# EAGLE design board (EAGLE 9.3.0)
CNAME: MAKER_Sensor_Node; CREVISION: V1.0; DESIGNER: Kihun Song
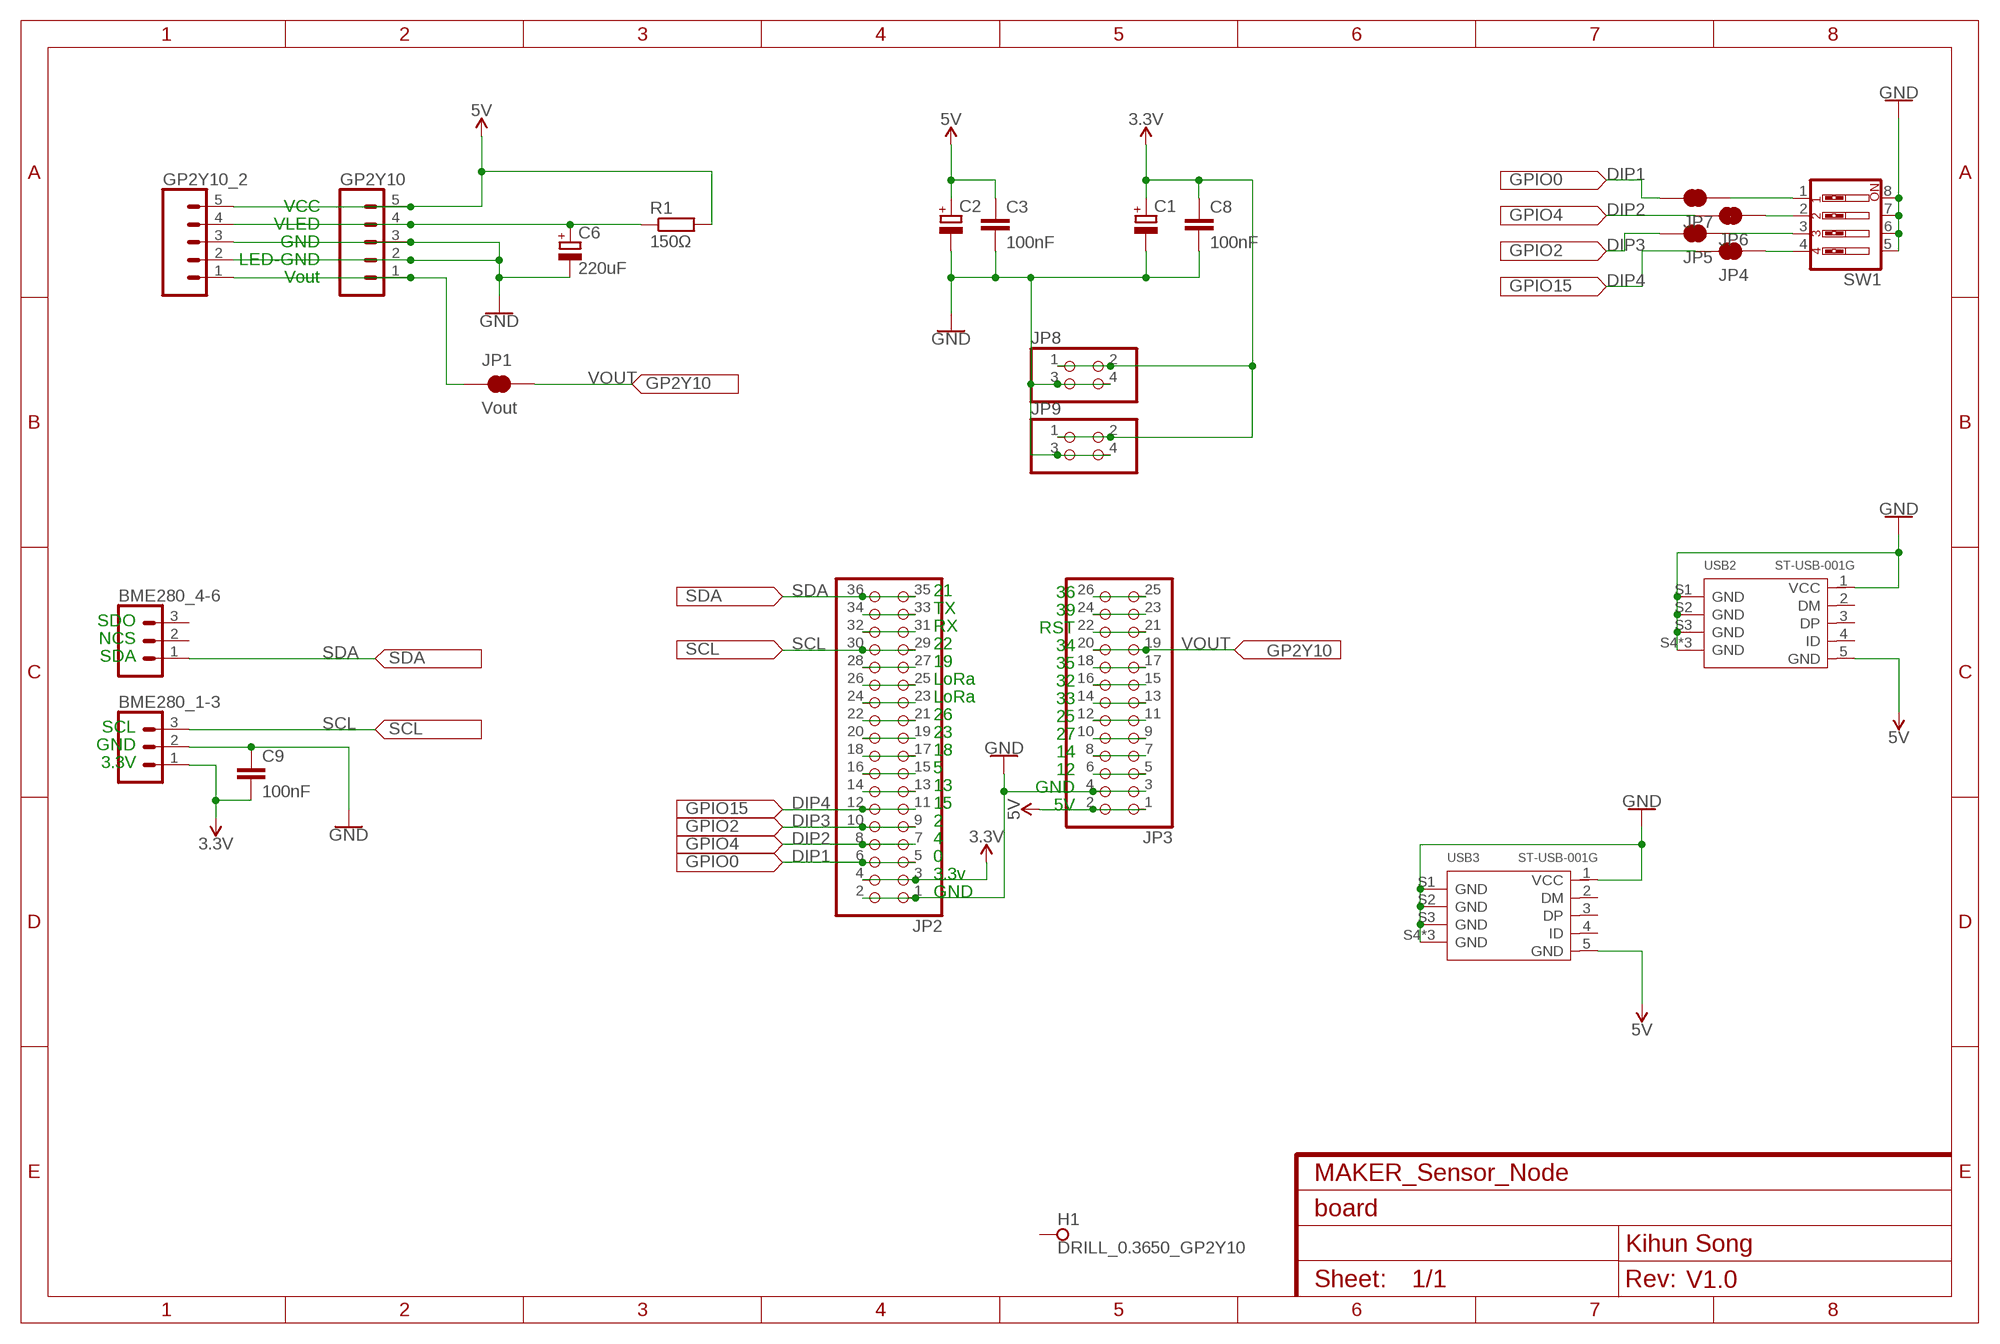
[diagram p0: schematic, sheet 1]

## Parts
BME280_1-3  CONN_03  [1X03]
BME280_4-6  CONN_03  [1X03]
C1  CPOL-EUD  [PANASONIC_D]
C2  CPOL-EUD  [PANASONIC_D]
C3  100nF  C-EUC0805  [C0805]
C6  220uF  CPOL-EUE2.5-5  [E2,5-5]
C8  100nF  C-EUC0805  [C0805]
C9  100nF  C-EUC0805  [C0805]
GP2Y10  CONN_05  [1X05]
GP2Y10_2  CONN_05PTH_LONGPADS  [1X05_LONGPADS]
H1  DRILL_0.3650_GP2Y10  SPECIAL_DRILL_0.3650  [PAD_0.3650]
JP1  Vout  JUMPER-SMT_2_NC_TRACE_SILK  [SMT-JUMPER_2_NC_TRACE_SILK]
JP2  PINHD-2X18  [2X18]
JP3  PINHD-2X13  [2X13]
JP4  JUMPER-SMT_2_NC_TRACE_SILK  [SMT-JUMPER_2_NC_TRACE_SILK]
JP5  JUMPER-SMT_2_NC_TRACE_SILK  [SMT-JUMPER_2_NC_TRACE_SILK]
JP6  JUMPER-SMT_2_NC_TRACE_SILK  [SMT-JUMPER_2_NC_TRACE_SILK]
JP7  JUMPER-SMT_2_NC_TRACE_SILK  [SMT-JUMPER_2_NC_TRACE_SILK]
JP8  PINHD-2X2/OCT  [2X02]
JP9  PINHD-2X2/OCT  [2X02]
R1  150Ω  R-EU_0204/7  [0204/7]
SW1  SW_DIP-4  [EDG-04]
USB2  ST-USB-001G  MICRO-USB-SMD-B-WITHOUT-POST-W/P(ST-USB-001G)  [MICRO-USB5+4P-SMD-0.65-B]
USB3  ST-USB-001G  MICRO-USB-SMD-B-WITHOUT-POST-W/P(ST-USB-001G)  [MICRO-USB5+4P-SMD-0.65-B]

## Nets
3.3V [power]: BME280_1-3.1 C1.+ C8.1 C9.2 JP2.3 JP2.4 JP8.1 JP8.2 JP9.1 JP9.2
5V [power]: C2.+ C3.1 GP2Y10.5 GP2Y10_2.5 JP3.1 JP3.2 R1.2 USB2.5(GND) USB3.5(GND)
DIP1: JP2.5 JP2.6 JP7.2
DIP2: JP2.7 JP2.8 JP6.2
DIP3: JP2.9 JP2.10 JP5.2
DIP4: JP2.11 JP2.12 JP4.2
GND [power]: BME280_1-3.2 C1.- C2.- C3.2 C6.- C8.2 C9.1 GP2Y10.2 GP2Y10.3 GP2Y10_2.2 GP2Y10_2.3 JP2.1 JP2.2 JP3.3 JP3.4 JP8.3 JP8.4 JP9.3 JP9.4 SW1.5 SW1.6 SW1.7 SW1.8 USB2.1(VCC) USB2.S1(GND) USB2.S2(GND) USB2.S3(GND) USB2.S4(GND) USB2.S5(GND) USB2.S6(GND) USB3.1(VCC) USB3.S1(GND) USB3.S2(GND) USB3.S3(GND) USB3.S4(GND) USB3.S5(GND) USB3.S6(GND)
N$1: JP7.1 SW1.1
N$2: JP6.1 SW1.2
N$4: JP2.33 JP2.34
N$5: JP2.31 JP2.32
N$7: JP2.27 JP2.28
N$8: JP2.25 JP2.26
N$9: JP3.25 JP3.26
N$10: JP3.23 JP3.24
N$11: JP3.21 JP3.22
N$12: JP3.17 JP3.18
N$13: JP5.1 SW1.3
N$14: JP3.15 JP3.16
N$15: JP3.13 JP3.14
N$16: JP3.11 JP3.12
N$17: JP3.9 JP3.10
N$18: JP3.7 JP3.8
N$19: JP3.5 JP3.6
N$21: JP4.1 SW1.4
N$28: JP2.13 JP2.14
N$29: JP2.15 JP2.16
N$30: JP2.17 JP2.18
N$31: JP2.19 JP2.20
N$32: JP2.21 JP2.22
N$33: JP2.23 JP2.24
SCL: BME280_1-3.3 JP2.29 JP2.30
SDA: BME280_4-6.1 JP2.35 JP2.36
VLED [power]: C6.+ GP2Y10.4 GP2Y10_2.4 R1.1
VOUT: JP1.2 JP3.19 JP3.20
VOUT_1: GP2Y10.1 GP2Y10_2.1 JP1.1
Unconnected: BME280_4-6.2 BME280_4-6.3 H1.1 USB2.2(DM) USB2.3(DP) USB2.4(ID) USB3.2(DM) USB3.3(DP) USB3.4(ID)

## Notes on the sheet
- VCC
- VLED
- GND
- LED-GND
- Vout
- 36
- 21
- 39
- SDO | TX
- RST
- NCS | RX
- 34
- SDA | 22
- 35
- 19
- 32
- LoRa
- 33
- LoRa
- 25
- SCL | 26
- 27
- GND | 23
- 14
- 3.3V | 18
- 12
- 5
- GND
- 13
- 5V
- 15
- 2
- 4
- 0
- 3.3v
- GND

## Library data of the parts
BME280_1-3 BME280_4-6 = SparkFun-Connectors:CONN_03: Multi connection point. Often used as Generic Header-pin footprint for 0.1 inch spaced/style header connections On any of the 0.1 inch spaced packages, you can populate with these: Break Away Headers - Straight <https://www.sparkfun.com/products/116> (PRT-00116) Break Away Male Headers - Right Angle <https://www.sparkfun.com/products/553> (PRT-00553) Female Headers <https://www.sparkfun.com/products/115> (PRT-00115) Break Away Headers - Machine Pin <https://www.sparkfun.com/products/117> (PRT-00117) Break Away Female Headers - Swiss Machine Pin <https://www.sparkfun.com/products/743> (PRT-00743) Stackable Header - 3 Pin (Female, 0.1") <https://www.sparkfun.com/products/13875> (PRT-13875) For SCREWTERMINALS and SPRING TERMINALS visit here: Screw Terimnals on SparkFun.com <https://www.sparkfun.com/search/results?term=Screw+Terminals> (5mm/3.5mm/2.54mm spacing) This device is also useful as a general connection point to wire up your design to another part of your project. Our various solder wires solder well into these plated through hole pads. Hook-Up Wire - Assortment (Stranded, 22 AWG) <https://www.sparkfun.com/products/11375> (PRT-11375) Hook-Up Wire - Assortment (Solid Core, 22 AWG) <https://www.sparkfun.com/products/11367> (PRT-11367) View the entire wire category on our website here <https://www.sparkfun.com/categories/141> Special notes: Molex polarized connector foot print use with SKU : PRT-08232 with associated crimp pins and housings.
C1 C2 C6 = rcl:CPOL-EU: POLARIZED CAPACITOR, European symbol; SPICEPREFIX: C
C3 C8 C9 = rcl:C-EU: CAPACITOR, European symbol; SPICEPREFIX: C
GP2Y10 GP2Y10_2 = SparkFun-Connectors:CONN_05: Multi connection point. Often used as Generic Header-pin footprint for 0.1 inch spaced/style header connections On any of the 0.1 inch spaced packages, you can populate with these: Break Away Headers - Straight <https://www.sparkfun.com/products/116> (PRT-00116) Break Away Male Headers - Right Angle <https://www.sparkfun.com/products/553> (PRT-00553) Female Headers <https://www.sparkfun.com/products/115> (PRT-00115) Break Away Headers - Machine Pin <https://www.sparkfun.com/products/117> (PRT-00117) Break Away Female Headers - Swiss Machine Pin <https://www.sparkfun.com/products/743> (PRT-00743) For SCREWTERMINALS and SPRING TERMINALS visit here: Screw Terimnals on SparkFun.com <https://www.sparkfun.com/search/results?term=Screw+Terminals> (5mm/3.5mm/2.54mm spacing) This device is also useful as a general connection point to wire up your design to another part of your project. Our various solder wires solder well into these plated through hole pads. Hook-Up Wire - Assortment (Stranded, 22 AWG) <https://www.sparkfun.com/products/11375> (PRT-11375) Hook-Up Wire - Assortment (Solid Core, 22 AWG) <https://www.sparkfun.com/products/11367> (PRT-11367) View the entire wire category on our website here <https://www.sparkfun.com/categories/141> Special notes: Molex polarized connector foot print use with SKU : PRT-08231 with associated crimp pins and housings. 1MM SMD Version SKU: PRT-10208
H1 = special-drill:SPECIAL_DRILL_: Special drills
JP1 JP4-JP7 = SparkFun-Jumpers:JUMPER-SMT_2_NC_TRACE: Normally closed trace jumper This jumper has a trace between two pads so it's normally closed (NC). Use a razor knife to open the connection. For best results follow the IPC guidelines for cutting traces: Cutout at least 0.063 mm (0.005 in). Remove all loose material to clean up the cut area. Seal the cut with an approved epoxy. Reapply solder to reclose the connection.
JP2 = pinhead:PINHD-2X18: PIN HEADER
JP3 = pinhead:PINHD-2X13: PIN HEADER
JP8 JP9 = pinhead_v2:PINHD-2X2: PIN HEADER
R1 = rcl:R-EU_: RESISTOR, European symbol; SPICEPREFIX: R
SW1 = special:SW_DIP-4: DIP SWITCH
USB2 USB3 = Seeed-Connector:MICRO-USB-SMD-B-WITHOUT-POST-W/P(ST-USB-001G): 320010000; MPN: ST-USB-001G

## Net classes
0 default: width 0.254 mm, clearance 0.205 mm
1 power: width 0.914 mm, clearance 0.254 mm

## Board
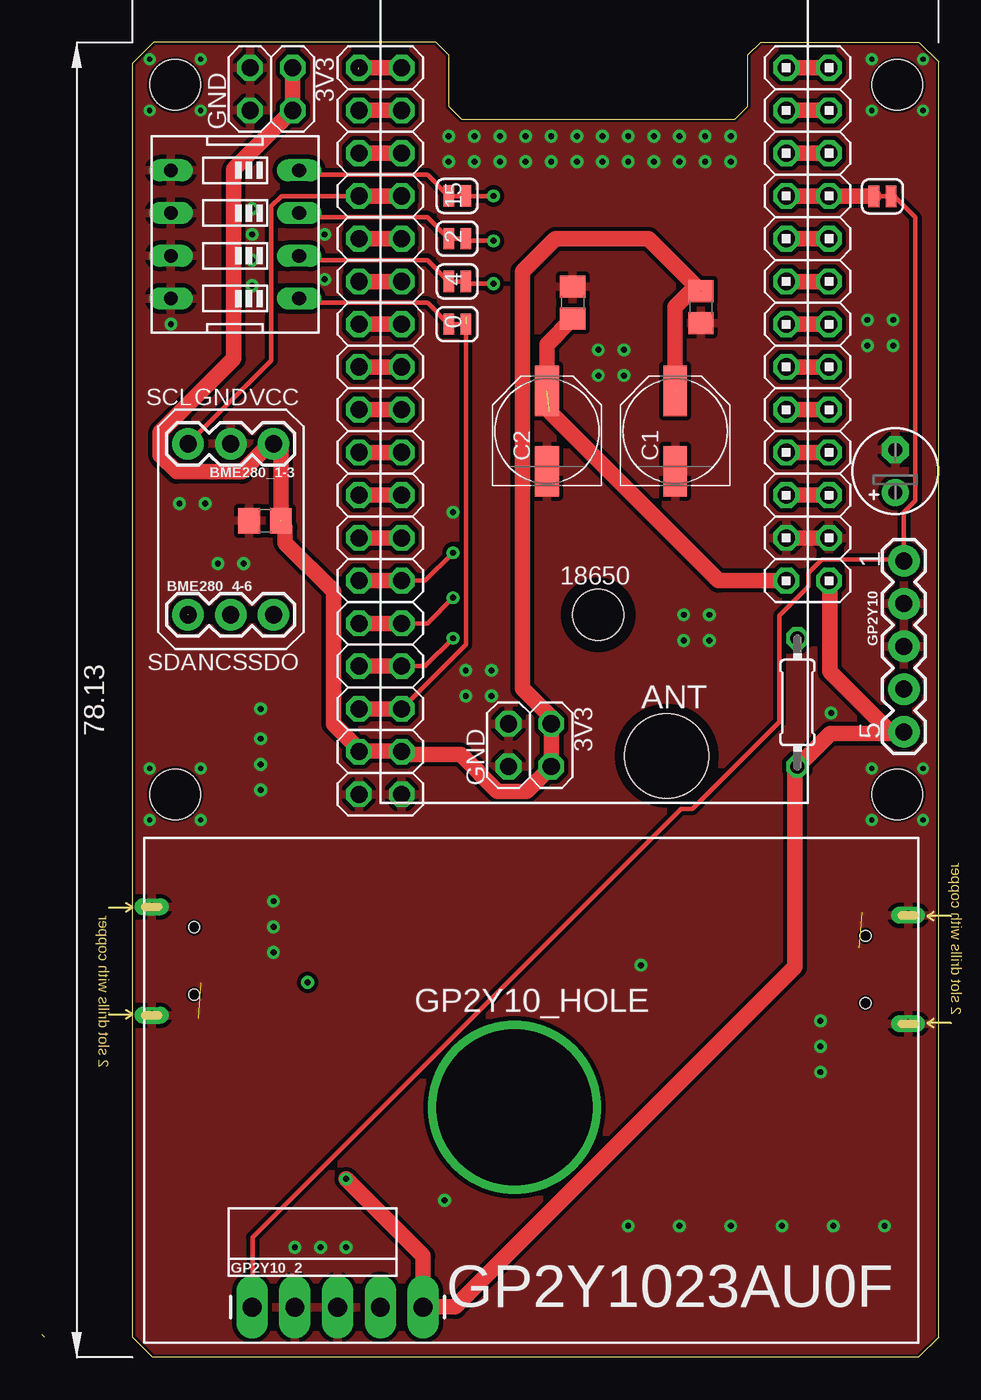
[diagram p1: board, top side]
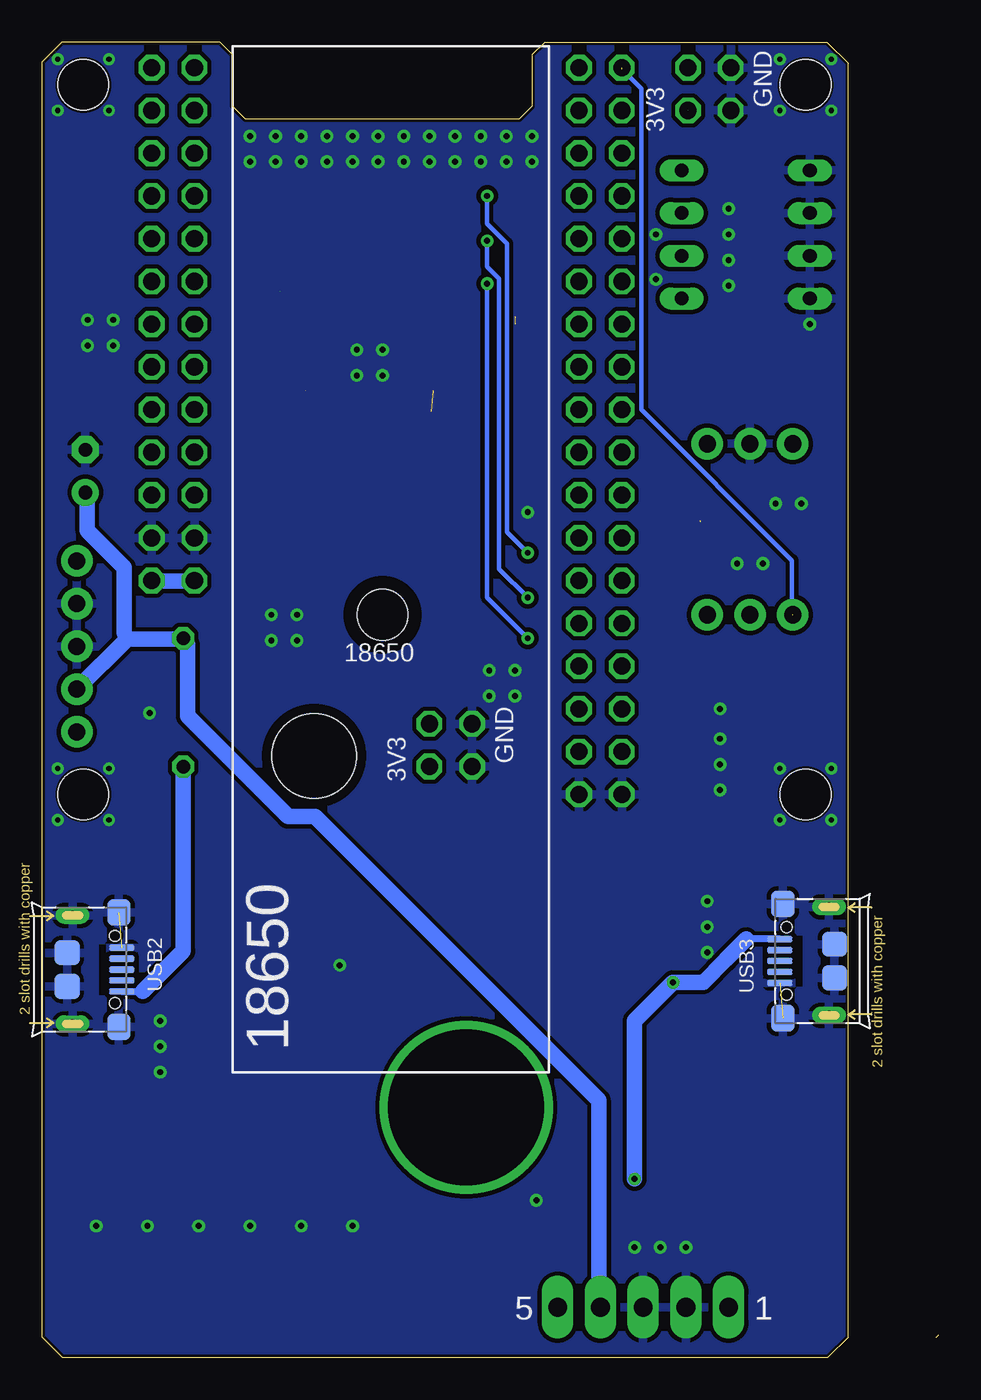
[diagram p2: board, bottom side, seen from below]

Size 53.29 x 78.17 mm. Coordinates in mm from the lower left corner, seen from the top.
Outline: 0.15,1.21 0,1.36
Outline: 23.41,78.17 24.17,77.41 24.17,74.36 24.93,73.6 41.19,73.6 41.95,74.36 41.95,77.41 42.71,78.17 52.11,78.17 53.29,76.99 53.29,1.21 52.08,0 6.58,0 5.37,1.21 5.37,76.9 6.64,78.17 23.41,78.17
Copper layers (1*16): Top 0.035mm / dielectric 1.5mm / Bottom 0.035mm
Design rules "default *": minimum track width 6mil, minimum drill 0.35mm, track to track 6mil, track to pad 6mil, pad to pad 6mil, via to via 6mil, smd to smd 6mil, copper to edge 6mil, drill to drill 6mil, minimum pad ring 10mil, minimum via ring 8mil, stop-mask expansion 4mil, vias tented up to drill 0mil, thermal gap 10mil
Holes 5 mm at 37.12,35.75
Holes 3 mm at 33.06,44.13 7.91,75.63 50.84,75.63 7.91,33.46 50.84,33.46
tRestrict: area 31.2,42.3 to 34.9,46; area 34.4,33.1 to 39.8,38.5
bRestrict: area 31.1,42.2 to 35,46.1; area 34.4,33.1 to 39.8,38.5

### Footprints (pad centres in the part's own frame; a part is rotated, then mirrored left to right if it is on the bottom)
1X03 = drill 1.016 pad 1.88: 1 0,0; 2 2.54,0; 3 5.08,0
PANASONIC_D = smd 3 x 1.4: + 2.4,0; - -2.4,0
C0805 = smd 1.3 x 1.5: 1 -0.95,0; 2 0.95,0
E2,5-5 = drill 0.813 pad 1.6: + -1.27,0 | drill 0.813 pad 1.6 octagon: - 1.27,0
1X05 = drill 1.016 pad 1.88: 1 0,0; 2 2.54,0; 3 5.08,0; 4 7.62,0; 5 10.16,0
1X05_LONGPADS = drill 1.118 pad 1.88 long: 1 0,0; 2 2.54,0; 3 5.08,0; 4 7.62,0; 5 10.16,0
PAD_0.3650 = drill 9.271 pad 9.271: 1 0,0
SMT-JUMPER_2_NC_TRACE_SILK = smd 0.635 x 1.27: 1 -0.508,0; 2 0.508,0
2X18 = drill 1.016 octagon: 1 -21.59,-1.27; 2 -21.59,1.27; 3 -19.05,-1.27; 4 -19.05,1.27; 5 -16.51,-1.27; 6 -16.51,1.27; 7 -13.97,-1.27; 8 -13.97,1.27; 9 -11.43,-1.27; 10 -11.43,1.27; 11 -8.89,-1.27; 12 -8.89,1.27; 13 -6.35,-1.27; 14 -6.35,1.27; 15 -3.81,-1.27; 16 -3.81,1.27; 17 -1.27,-1.27; 18 -1.27,1.27; 19 1.27,-1.27; 20 1.27,1.27; 21 3.81,-1.27; 22 3.81,1.27; 23 6.35,-1.27; 24 6.35,1.27; 25 8.89,-1.27; 26 8.89,1.27; 27 11.43,-1.27; 28 11.43,1.27; 29 13.97,-1.27; 30 13.97,1.27; 31 16.51,-1.27; 32 16.51,1.27; 33 19.05,-1.27; 34 19.05,1.27; 35 21.59,-1.27; 36 21.59,1.27
2X13 = drill 1.016 octagon: 1 -15.24,-1.27; 2 -15.24,1.27; 3 -12.7,-1.27; 4 -12.7,1.27; 5 -10.16,-1.27; 6 -10.16,1.27; 7 -7.62,-1.27; 8 -7.62,1.27; 9 -5.08,-1.27; 10 -5.08,1.27; 11 -2.54,-1.27; 12 -2.54,1.27; 13 0,-1.27; 14 0,1.27; 15 2.54,-1.27; 16 2.54,1.27; 17 5.08,-1.27; 18 5.08,1.27; 19 7.62,-1.27; 20 7.62,1.27; 21 10.16,-1.27; 22 10.16,1.27; 23 12.7,-1.27; 24 12.7,1.27; 25 15.24,-1.27; 26 15.24,1.27
2X02 = drill 1.016 octagon: 1 -1.27,-1.27; 2 -1.27,1.27; 3 1.27,-1.27; 4 1.27,1.27
0204/7 = drill 0.813 octagon: 1 -3.81,0; 2 3.81,0
EDG-04 = drill 0.813 long: 1 -3.81,-3.81; 2 -1.27,-3.81; 3 1.27,-3.81; 4 3.81,-3.81; 5 3.81,3.81; 6 1.27,3.81; 7 -1.27,3.81; 8 -3.81,3.81
MICRO-USB5+4P-SMD-0.65-B = smd 0.381 x 1.524: 1 -1.3,-0.25; 2 -0.65,-0.25; 3 0,-0.25; 4 0.65,-0.25; 5 1.3,-0.25 | smd 1.6 x 1.397: S1 -3.4,-0.427; S6 3.4,-0.427 | drill 0.508 pad 1.016 long: S2 -3.226,-3.175; S5 3.226,-3.175 | smd 1.5 x 1.5: S3 -1,-3.5; S4 1,-3.5 | hole 0.635: -2,-0.65; 2,-0.65

### Placement (x,y rotation side)
BME280_1-3  13.75,54.29 180 top
BME280_4-6  8.67,44.13 0 top
C1  37.63,55.05 90 top
C2  30.01,55.05 90 top
C3  31.53,62.67 90 top
C6  50.71,52.67 90 top
C8  39.15,62.42 270 top
C9  13.25,49.72 0 top
GP2Y10  51.22,47.33 270 top
GP2Y10_2  12.48,2.98 0 top
H1  28.08,14.86 0 top
JP1  49.95,69 180 top
JP2  20.1,55.05 90 top
JP3  45.5,61.4 90 top
JP4  24.68,69.02 0 top
JP5  24.68,66.48 0 top
JP6  24.68,63.94 0 top
JP7  24.68,61.4 0 top
JP8  13.63,75.37 180 top
JP9  28.99,36.39 180 top
R1  44.9,38.92 270 top
SW1  11.47,66.74 90 top
USB2  48.3,23.05 270 bottom
USB3  9.69,23.56 90 bottom

### Tracks (layer width: path | path; a pad name or v marks a point on that pad's centre or on a via)
3.3V  (6 unrouted)
  Top 0.914: 14.12,49.79 C9.2 | C8.1 39.1,63.34 38.53,63.34 37.61,62.42 37.61,57.48 C1.+ | 14.16,49.68 14.45,49.32 14.45,48.4 17.32,45.53 17.32,37.65 18.59,36.39 JP2.4 18.93,36.05 21.34,36.05 JP2.3 21.8,35.82 24.9,35.82 27.08,33.64 28.8,33.64 29.95,34.79 JP9.2 30.29,35.13 30.29,37.65 JP9.1 30.18,38.11 28.54,39.74 28.54,64.51 30.52,66.48 36.04,66.48 C8.1 | JP8.1 JP8.2 11.4,70.6 11.4,59.35 7.02,54.98 7.02,53.61 7.99,52.64 11.9,52.64 13.55,54.29 BME280_1-3.1 14.2,53.85 C9.2
5V  (via drill 0.35)  (1 unrouted)
  Top 0.914: 50.37,37.08 51.17,37.08 GP2Y10.5 | 44.98,35.13 R1.2 | R1.2 44.75,34.67 44.75,23.2 24.55,3 22.72,3 GP2Y10_2.5 22.64,6.03 v18.07,10.6 | JP3.1 46.81,46.15 46.81,40.75 50.14,37.43 50.37,37.08 | JP3.2 40.21,46.16 30.15,56.22 | C3.1 30.01,60.2 C2.+ | R1.2 46.86,37.08 50.37,37.08
  Bottom 0.406: USB2.5 47.3,21.75 | USB3.5 11.44,24.86
  Bottom 0.914: JP3.2 44.29,46.15 46.7,46.15 JP3.1 | R1.2 44.9,24.15 47.3,21.75 | 11.44,24.86 12.67,23.63 12.67,23.62 13.99,22.29 v15.79,22.29 18.07,20 v18.07,10.6
DIP1  (1 unrouted)
  Top 0.254: JP2.5 25.18,42.35 25.18,61.86
  Top 0.914: JP2.6 JP2.5
DIP2  (via drill 0.35)
  Top 0.254: JP2.7 22.77,41.08 v24.42,42.74 | JP6.2 25.31,63.82 v26.84,63.82
  Top 0.914: JP2.8 JP2.7
  Bottom 0.254: v24.42,42.74 26.84,45.15 v26.84,63.82
DIP3  (via drill 0.35)
  Top 0.254: JP2.9 22.9,43.62 v24.42,45.15 | JP5.2 25.31,66.36 v26.84,66.36
  Top 0.914: JP2.10 JP2.9
  Bottom 0.254: v26.84,66.36 26.84,64.82 26.13,64.11 26.13,46.85 v24.42,45.15
DIP4  (via drill 0.35)
  Top 0.254: JP2.11 22.77,46.16 v24.42,47.82 | JP4.2 v26.84,69.02
  Top 0.914: JP2.12 JP2.11
  Bottom 0.254: v24.42,47.82 25.67,49.06 25.67,66.19 26.84,67.36 v26.84,69.02
GND  (via drill 0.3, 0.35)  (2 unrouted)
  Top 0.914: JP3.3 JP3.4
  other vias: 35.6,23.3 23.91,9.33 16.8,66.74 16.8,64.07 24.42,50.23 7.66,61.4 46.9,38.29 46.27,20 46.27,18.48 46.27,16.95 15.02,6.54 16.55,6.54 18.07,6.54 13.75,27.11 13.75,25.59 13.75,24.07 12.99,38.54 12.99,36.77 12.99,35.24 12.99,33.72 12.48,68.26 12.48,66.74 12.48,65.21 12.48,63.69 36.36,72.58 37.88,72.58 39.41,72.58 40.93,72.58 30.26,72.58 31.79,72.58 33.31,72.58 34.84,72.58 24.17,72.58 25.69,72.58 27.22,72.58 28.74,72.58 36.36,71.06 37.88,71.06 39.41,71.06 40.93,71.06 30.26,71.06 31.79,71.06 33.31,71.06 34.84,71.06 24.17,71.06 25.69,71.06 27.22,71.06 28.74,71.06 37.88,7.81 34.84,7.81 43.98,7.81 40.93,7.81 50.08,7.81 47.03,7.81 33.06,59.88 34.58,59.88 33.06,58.36 34.58,58.36 38.14,44.13 39.66,44.13 38.14,42.61 39.66,42.61 25.18,40.83 26.71,40.83 25.18,39.31 26.71,39.31 10.45,47.18 11.98,47.18 8.17,50.74 9.69,50.74 49.06,61.66 50.58,61.66 49.06,60.13 50.58,60.13 9.44,77.15 9.44,74.1 6.39,77.15 6.39,74.1 52.36,77.15 52.36,74.1 49.31,77.15 49.31,74.1 49.31,34.99 52.36,34.99 49.31,31.94 52.36,31.94 6.39,34.99 9.44,34.99 6.39,31.94 9.44,31.94
  pour Bottom: -21.04,104.33 -21.04,-22.67 80.56,-22.67 80.56,104.33
  pour Top: -21.04,104.33 -21.04,-22.67 80.56,-22.67 80.56,104.33
N$1
  Top 0.254: SW1.1 15.53,62.67 22.9,62.67 JP7.1
N$2
  Top 0.254: SW1.2 15.53,65.21 22.9,65.21 JP6.1
N$4
  Top 0.914: JP2.34 JP2.33
N$5
  Top 0.914: JP2.31 JP2.32
N$7
  Top 0.914: JP2.27 JP2.28
N$8
  Top 0.914: JP2.26 JP2.25
N$9
  Top 0.914: JP3.26 JP3.25
N$10
  Top 0.914: JP3.24 JP3.23
N$11
  Top 0.914: JP3.22 JP3.21
N$12
  Top 0.914: JP3.18 JP3.17
N$13
  Top 0.254: SW1.3 15.53,67.75 22.9,67.75 JP5.1
N$14
  Top 0.914: JP3.15 JP3.16
N$15
  Top 0.914: JP3.14 JP3.13
N$16
  Top 0.914: JP3.12 JP3.11
N$17
  Top 0.914: JP3.10 JP3.9
N$18
  Top 0.914: JP3.7 JP3.8
N$19
  Top 0.914: JP3.6 JP3.5
N$21
  Top 0.254: SW1.4 15.53,70.29 22.9,70.29 JP4.1
N$28
  Top 0.914: JP2.14 JP2.13
N$29
  Top 0.914: JP2.16 JP2.15
N$30
  Top 0.914: JP2.17 JP2.18
N$31
  Top 0.914: JP2.20 JP2.19
N$32
  Top 0.914: JP2.22 JP2.21
N$33
  Top 0.914: JP2.23 JP2.24
SCL
  Top 0.254: JP2.30 14.23,69.02 13.63,68.42 13.63,59.24 BME280_1-3.3
  Top 0.914: JP2.30 JP2.29
SDA  (2 unrouted)
  Top 0.914: JP2.36 JP2.35
  Bottom 0.254: 18.82,76.56 17.67,75.41 17.67,56.32 8.72,47.37 8.72,44.14 BME280_4-6.1
VLED
  Bottom 0.914: 48.19,42.7 44.98,42.7 R1.1 44.63,42.36 44.63,38.11 38.67,32.15 37.06,32.15 20.19,15.28 20.19,3 GP2Y10_2.4 | C6.+ 50.6,51.31 50.6,49.13 48.42,46.95 48.42,43.05 48.19,42.7 | 48.19,42.7 48.23,42.7 GP2Y10.4
VOUT
  Top 0.914: JP3.20 JP3.19 49.41,69.02 JP1.2
VOUT_1
  Top 0.254: GP2Y10_2.1 12.5,3 12.5,7.13 37.98,32.61 38.67,32.61 43.83,37.77 43.83,44.08 45.55,45.8 45.55,46.61 46.35,47.41 51.15,47.41 GP2Y10.1 51.22,50.24 51.9,50.91 51.9,67.75 50.65,69 JP1.1

### Text on the board
tPlace: 3V3 | GND | 15 | 2 | 4 | 0 | SCL | GND | VCC | 1 | 18650 | SDA | NCS | SDO | 3V3 | ANT | 5 | GND | GP2Y10_HOLE | GP2Y1023AU0F
bPlace: GND | 3V3 | 18650 | GND | 3V3 | 18650 | 1 | 5